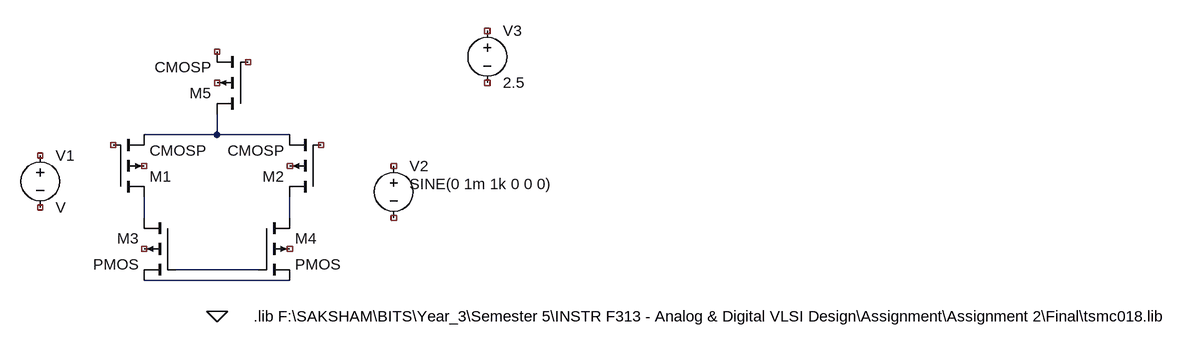
[diagram p0: schematic Draft1.asc]
Draft1.asc, the LTspice schematic file:
Version 4
SHEET 1 1724 680
WIRE 208 48 208 16
WIRE 208 48 96 48
WIRE 320 48 208 48
WIRE 96 176 96 144
WIRE 320 176 320 144
WIRE 272 256 144 256
WIRE 320 272 96 272
FLAG 208 320 0
SYMBOL pmos4 48 144 M180
SYMATTR InstName M1
SYMATTR Value CMOSP
SYMBOL pmos4 368 144 R180
SYMATTR InstName M2
SYMATTR Value CMOSP
SYMBOL pmos4 144 176 M0
SYMATTR InstName M3
SYMBOL pmos4 272 176 R0
SYMATTR InstName M4
SYMBOL pmos4 256 16 R180
SYMATTR InstName M5
SYMATTR Value CMOSP
SYMBOL voltage -64 64 R0
SYMATTR InstName V1
SYMBOL voltage 480 80 R0
WINDOW 3 24 44 Left 2
WINDOW 123 0 0 Left 2
WINDOW 39 0 0 Left 2
SYMATTR InstName V2
SYMATTR Value SINE(0 1m 1k 0 0 0)
SYMBOL voltage 624 -128 R0
WINDOW 123 0 0 Left 2
WINDOW 39 0 0 Left 2
SYMATTR InstName V3
SYMATTR Value 2.5
TEXT 264 328 Left 2 !.lib F:\\SAKSHAM\\BITS\\Year_3\\Semester 5\\INSTR F313 - Analog & Digital VLSI Design\\Assignment\\Assignment 2\\Final\\tsmc018.lib

The netlist it stands for:
* Draft1.asc
M1 N002 NC_01 N001 NC_02 CMOSP
M2 N003 NC_03 N001 NC_04 CMOSP
M3 N002 N004 N005 NC_05 PMOS
M4 N003 N004 N005 NC_06 PMOS
M5 N001 NC_07 NC_08 NC_09 CMOSP
V1 NC_10 NC_11 V
V2 NC_12 NC_13 SINE(0 1m 1k 0 0 0)
V3 NC_14 NC_15 2.5
.model NMOS NMOS
.model PMOS PMOS
.lib standard.mos
.lib F:\SAKSHAM\BITS\Year_3\Semester 5\INSTR F313 - Analog & Digital VLSI Design\Assignment\Assignment 2\Final\tsmc018.lib
.backanno
.end